# EAGLE schematic 5VPart (EAGLE 9.6.2)
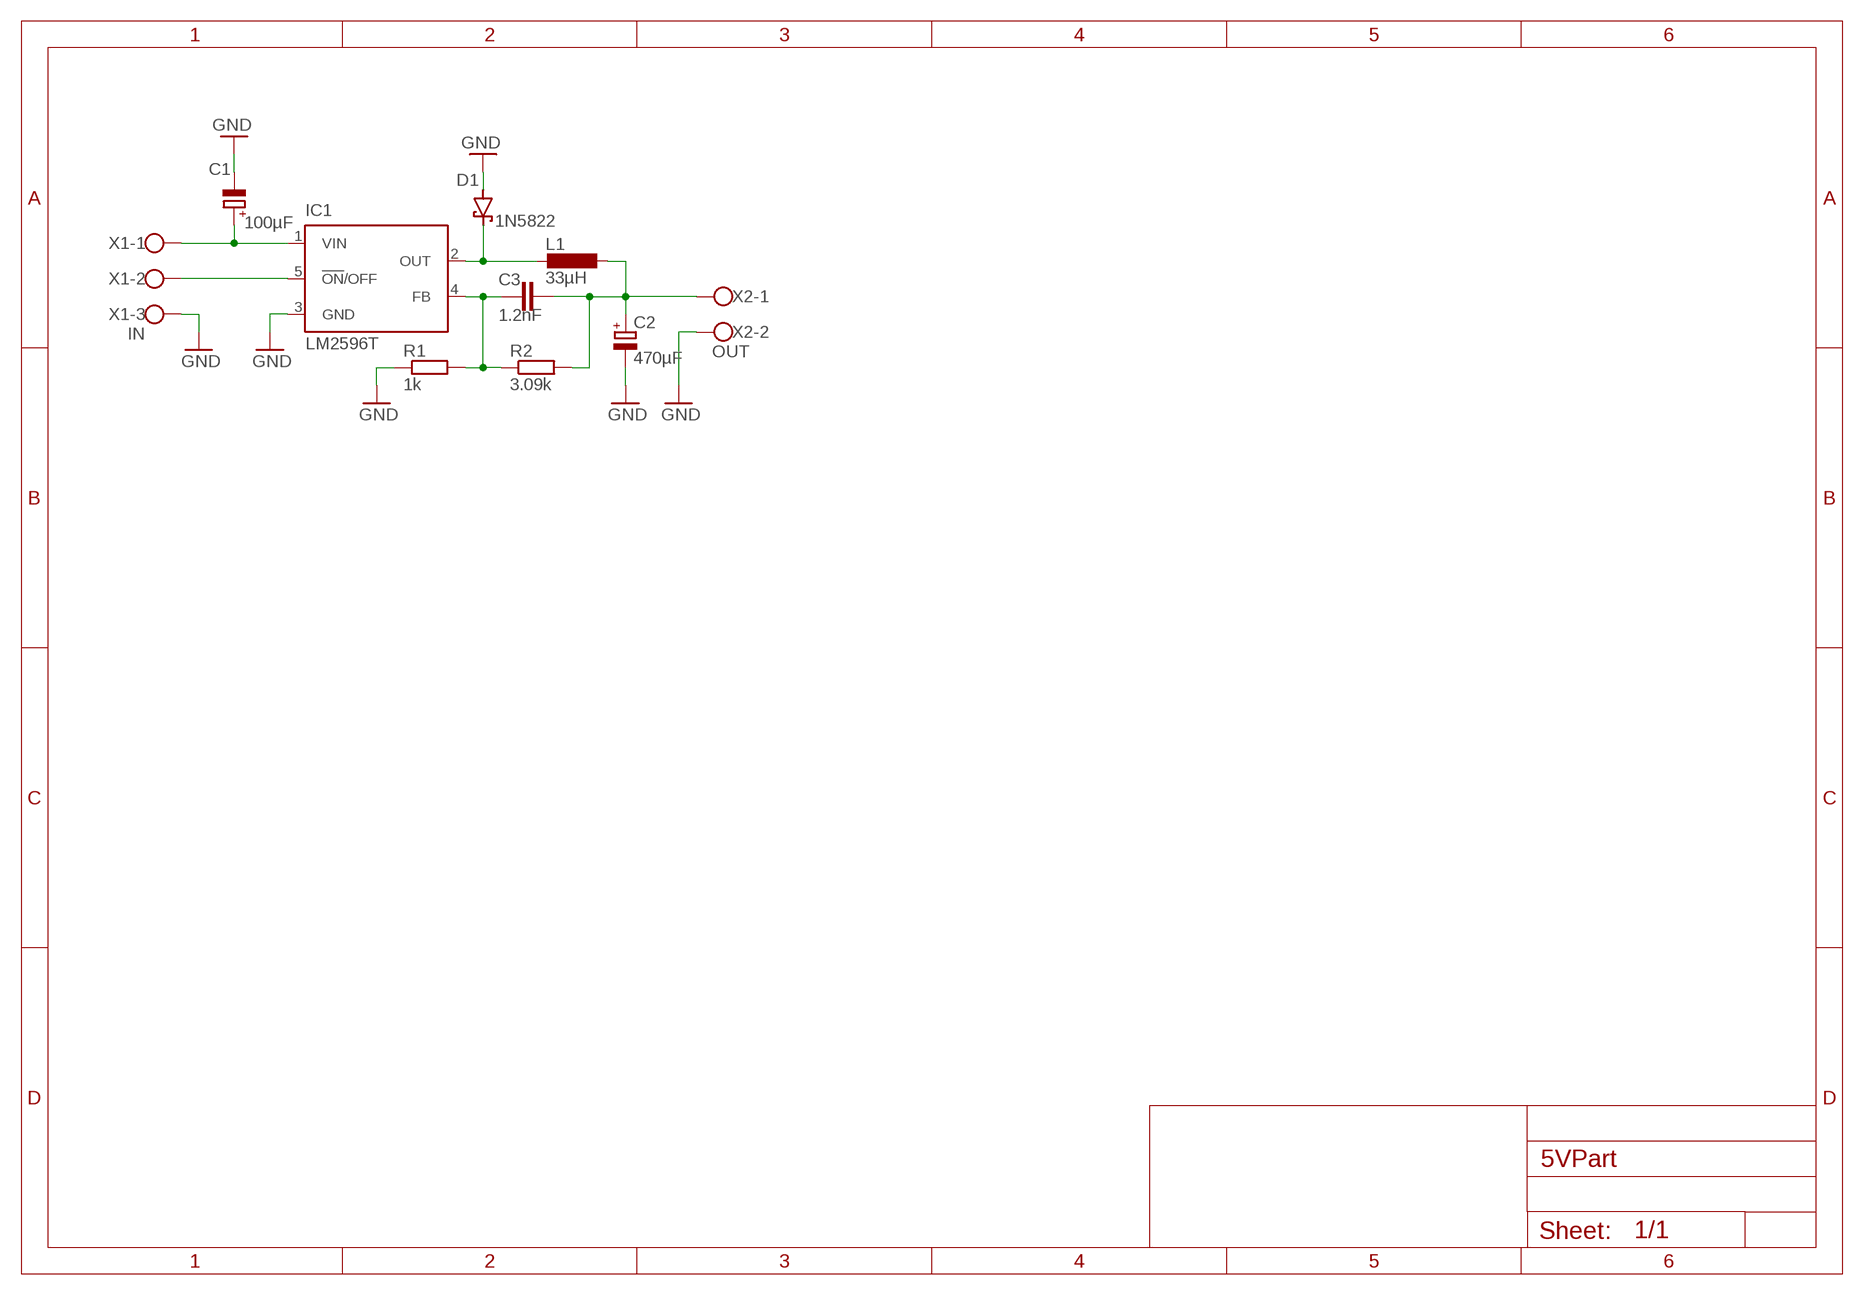
[diagram p0: schematic, sheet 1]

## Parts
C1  100µF  CPOL-EUE2.5-6  [E2,5-6]
C2  470µF  CPOL-EUE2.5-6  [E2,5-6]
C3  1.2nF  C-EU050-024X044  [C050-024X044]
D1  1N5822  SCHOTTKY-DIODEC4111-15  [C4111-15]
IC1  LM2596T  [T05D]
L1  33µH  L-EUTJ3-U2  [TJ3-U2]
R1  1k  R-EU_0207/10  [0207/10]
R2  3.09k  R-EU_0207/10  [0207/10]
X1  IN  W237-103  [W237-103]
X2  OUT  W237-102  [W237-102]

## Nets
GND: C1.- C2.- D1.A IC1.3(GND) R1.1 X1.3 X2.2
N$1: C3.1 IC1.4(FB) R1.2 R2.1
N$2: IC1.5(!ON!/OFF) X1.2
N$3: C2.+ C3.2 L1.1 R2.2 X2.1
N$4: D1.C IC1.2(OUT) L1.2
N$5: C1.+ IC1.1(VIN) X1.1

## Library data of the parts
C1 C2 = rcl:CPOL-EU: POLARIZED CAPACITOR, European symbol; SPICEPREFIX: C
C3 = rcl:C-EU: CAPACITOR, European symbol; SPICEPREFIX: C
D1 = diode:SCHOTTKY-DIODE: Schottky Diode
IC1 = national-semiconductor:LM2596: SIMPLE SWITCHER® Power Converter 150 kHz 3A Step-Down Voltage Regulator Source: http://www.national.com/ds/LM/LM2596.pdf; MPN: LM2596T-ADJ/LF02; OC_FARNELL: 9494162; OC_NEWARK: 65K5910
L1 = rcl:L-EU: INDUCTOR, European symbol; SPICEPREFIX: L
R1 R2 = rcl:R-EU_: RESISTOR, European symbol; SPICEPREFIX: R
X1 = con-wago-500:W237-103: WAGO SCREW CLAMP; MPN: 237-103; OC_FARNELL: unknown; OC_NEWARK: 18M7116
X2 = con-wago-500:W237-102: WAGO SCREW CLAMP; MPN: 237-102; OC_FARNELL: unknown; OC_NEWARK: 70K9898